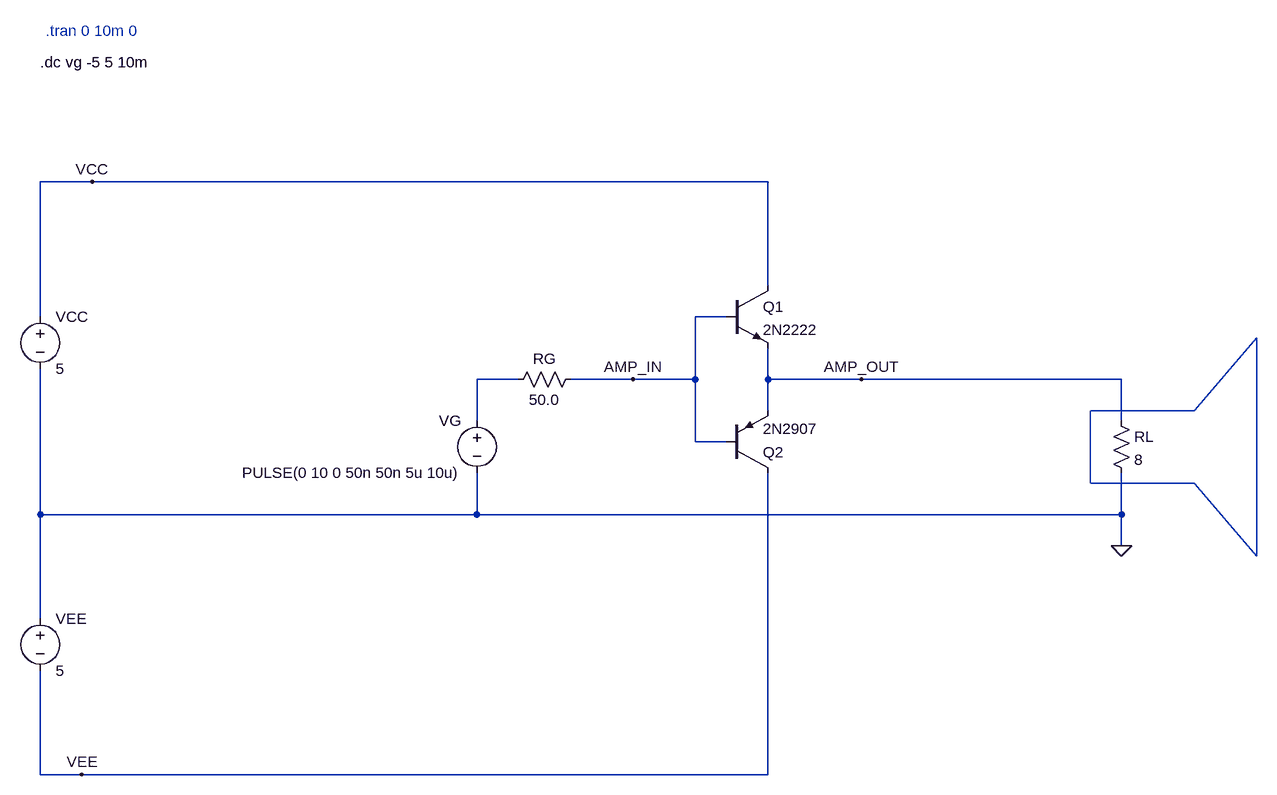
[diagram p0: schematic Push_Pull_Sim.asc]
Push_Pull_Sim.asc, the LTspice schematic file:
Version 4.1
SHEET 1 1932 1036
WIRE -784 80 -864 80
WIRE 256 80 -784 80
WIRE 256 240 256 80
WIRE -864 288 -864 80
WIRE 192 288 144 288
WIRE -128 384 -192 384
WIRE 48 384 -48 384
WIRE 144 384 144 288
WIRE 144 384 48 384
WIRE 256 384 256 336
WIRE 400 384 256 384
WIRE 800 384 400 384
WIRE 256 432 256 384
WIRE -192 448 -192 384
WIRE 800 448 800 384
WIRE 144 480 144 384
WIRE 192 480 144 480
WIRE -864 592 -864 368
WIRE -192 592 -192 528
WIRE -192 592 -864 592
WIRE 800 592 800 528
WIRE 800 592 -192 592
WIRE 800 640 800 592
WIRE -864 752 -864 592
WIRE -864 992 -864 832
WIRE -800 992 -864 992
WIRE 256 992 256 528
WIRE 256 992 -800 992
FLAG 400 384 AMP_OUT
FLAG 48 384 AMP_IN
FLAG 800 640 0
FLAG -784 80 VCC
FLAG -800 992 VEE
SYMBOL npn 192 240 R0
SYMATTR InstName Q1
SYMATTR Value 2N2222
SYMBOL pnp 192 528 M180
SYMATTR InstName Q2
SYMATTR Value 2N2907
SYMBOL voltage -864 272 R0
WINDOW 123 0 0 Left 0
WINDOW 39 0 0 Left 0
SYMATTR InstName VCC
SYMATTR Value 5
SYMBOL voltage -192 432 M0
WINDOW 123 0 0 Left 0
WINDOW 39 0 0 Left 0
SYMATTR InstName VG
SYMATTR Value PULSE(0 10 0 50n 50n 5u 10u)
SYMBOL res -144 400 R270
WINDOW 0 32 56 VTop 2
WINDOW 3 0 56 VBottom 2
SYMATTR InstName RG
SYMATTR Value 50.0
SYMBOL voltage -864 736 R0
WINDOW 123 0 0 Left 0
WINDOW 39 0 0 Left 0
SYMATTR InstName VEE
SYMATTR Value 5
SYMBOL res 784 432 R0
SYMATTR InstName RL
SYMATTR Value 8
TEXT -856 -152 Left 2 ;.tran 0 10m 0
TEXT -864 -104 Left 2 !.dc vg -5 5 10m
LINE Normal 912 432 752 432
LINE Normal 912 544 752 544
LINE Normal 752 544 752 432
LINE Normal 912 432 1008 320
LINE Normal 912 544 1008 656
LINE Normal 1008 656 1008 320

The netlist it stands for:
* Push_Pull_Sim.asc
Q1 VCC AMP_IN AMP_OUT 0 2N2222
Q2 VEE AMP_IN AMP_OUT 0 2N2907
VCC VCC 0 5
VG N001 0 PULSE(0 10 0 50n 50n 5u 10u)
RG N001 AMP_IN 50.0
VEE 0 VEE 5
RL AMP_OUT 0 8
.model NPN NPN
.model PNP PNP
.lib standard.bjt
* .tran 0 10m 0
.dc vg -5 5 10m
.backanno
.end